# Altium schematic sheet [3]-LEDBoard.SchDoc
size B; SheetNumber: 1; SheetTotal: 2
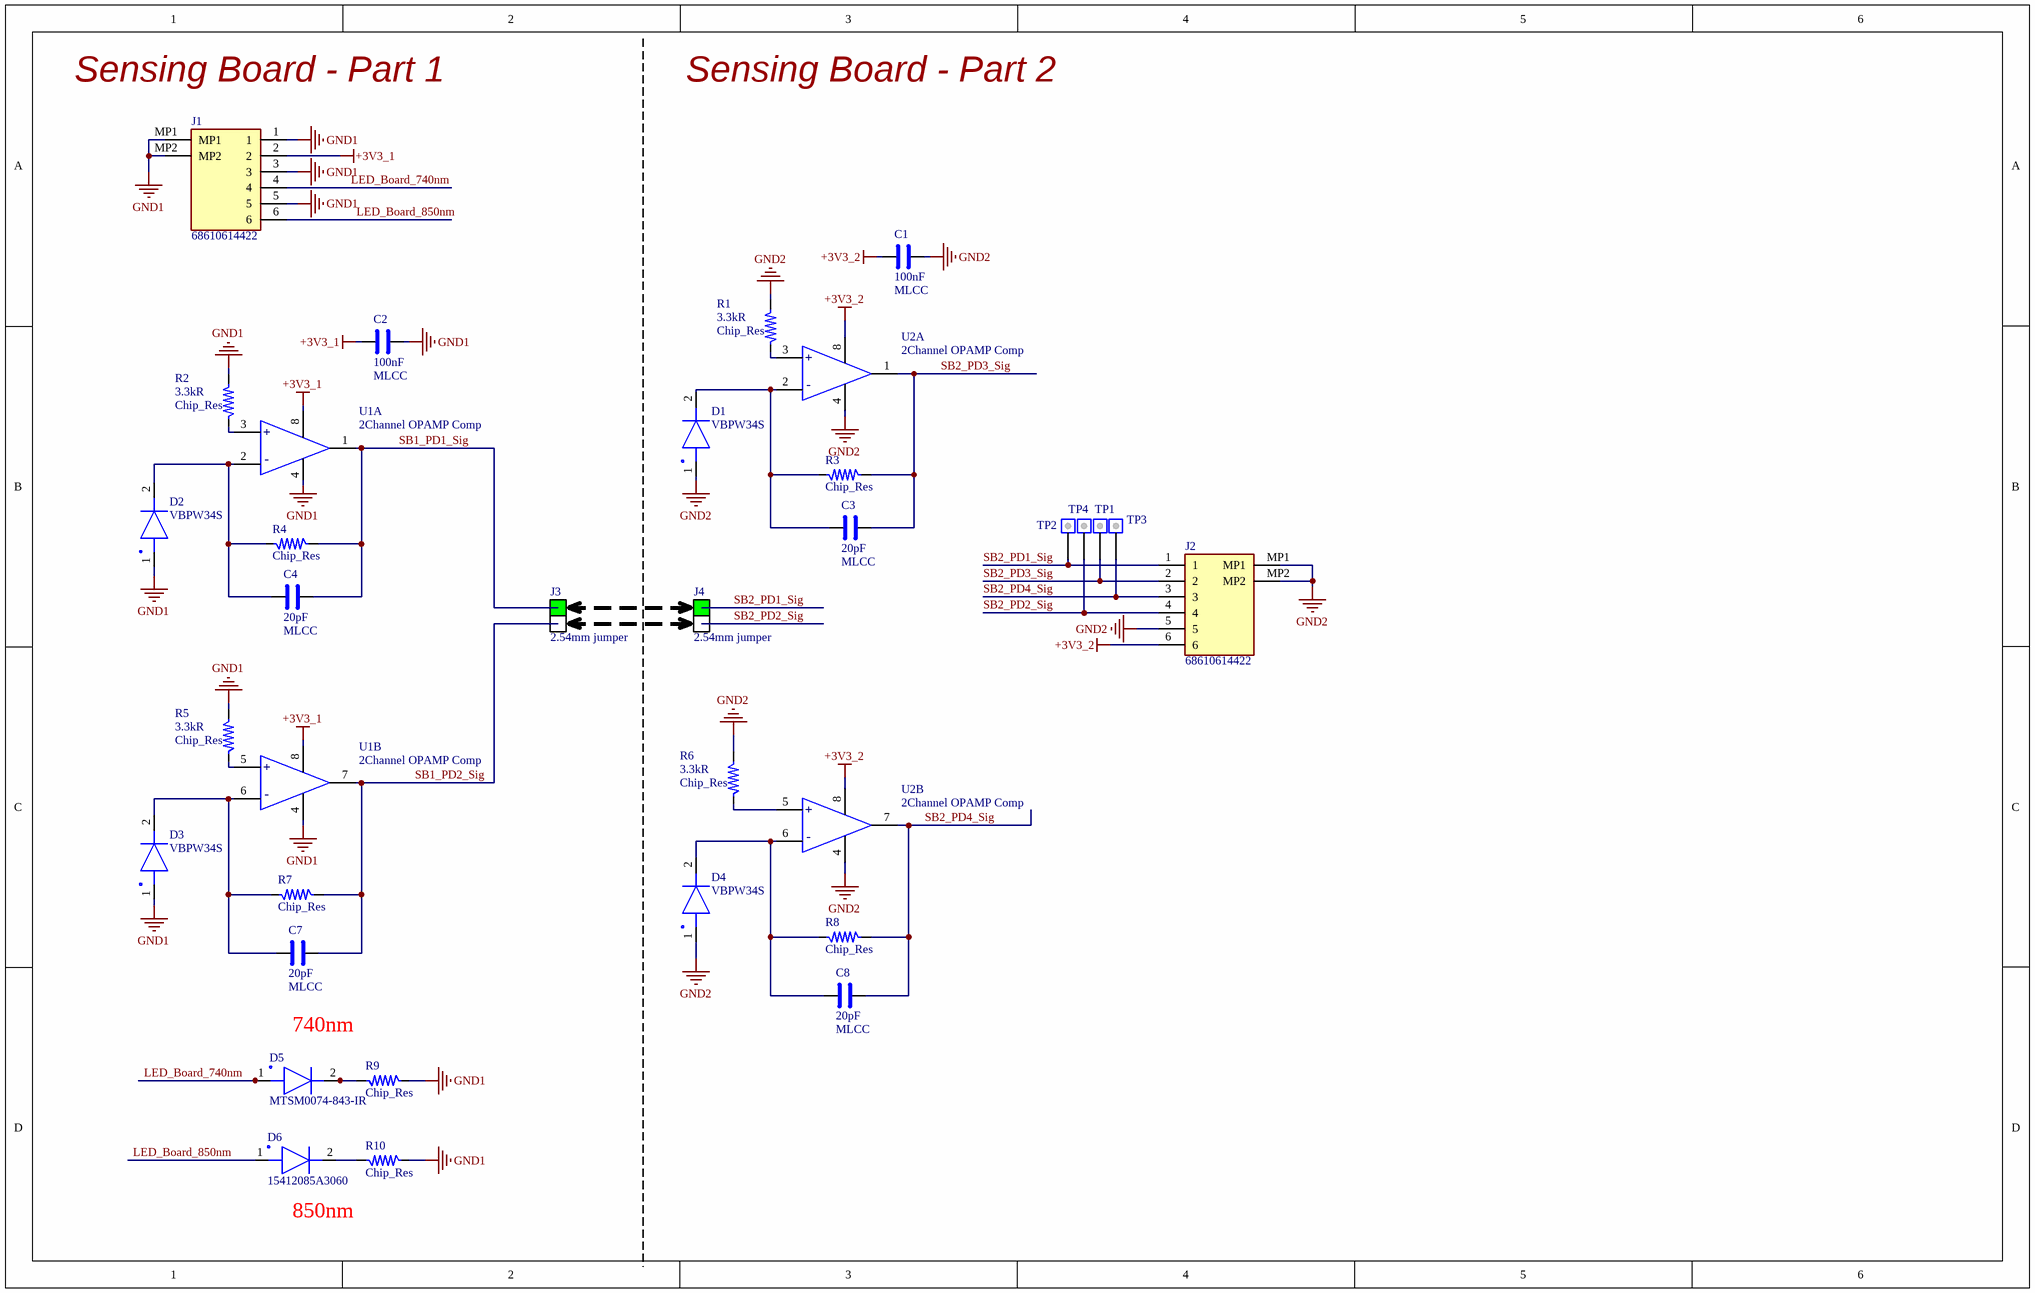
[diagram p0: [3]-LEDBoard.SchDoc]

## Parts
C1  MLCC  value 100nF  [CAPC1005X06L]
C2  MLCC  value 100nF  [CAPC1005X06L]
C3  MLCC  value 20pF  [CAPC1608X09M]
C4  MLCC  value 20pF  [CAPC1608X09M]
C7  MLCC  value 20pF  [CAPC1608X09M]
C8  MLCC  value 20pF  [CAPC1608X09M]
D1  VBPW34S  [VBPW34S]
D2  VBPW34S  [VBPW34S]
D3  VBPW34S  [VBPW34S]
D4  VBPW34S  [VBPW34S]
D5  MTSM0074-843-IR  [MTSM0074-843-IR]
D6  15412085A3060  [15412085A3060]
J1  68610614422  [68610614422]
J2  68610614422  [68610614422]
J3  2.54mm jumper  [FP_Jumper_2x2_54mm]
J4  2.54mm jumper  [FP_Jumper_2x2_54mm]
R1  Chip_Res  value 3.3kR  [RESC1005X04M]
R2  Chip_Res  value 3.3kR  [RESC1005X04M]
R3  Chip_Res  [RESC1608X06M]
R4  Chip_Res  [RESC1608X06M]
R5  Chip_Res  value 3.3kR  [RESC1005X04M]
R6  Chip_Res  value 3.3kR  [RESC1005X04M]
R7  Chip_Res  [RESC1608X06M]
R8  Chip_Res  [RESC1608X06M]
R9  Chip_Res  [RESC1608X06M]
R10  Chip_Res  [RESC1608X06M]
TP1  TP  [FP-TP_SMD_Narrow]  (value not drawn)
TP2  TP  [FP-TP_SMD_Narrow]  (value not drawn)
TP3  TP  [FP-TP_SMD_Narrow]  (value not drawn)
TP4  TP  [FP-TP_SMD_Narrow]  (value not drawn)
U1  2Channel OPAMP Comp  [TSOP65P490X110-8L]  (parts A,B of 2)
U2  2Channel OPAMP Comp  [TSOP65P490X110-8L]  (parts A,B of 2)

## Nets
+3V3_1: C2.1 J1.2 U1.8(VCC)
+3V3_2: C1.1 J2.6 U2.8(VCC)
GND1: C2.2 D2.1(Anode) D3.1(Anode) J1.1 J1.3 J1.5 J1.MP1 J1.MP2 R2.1 R5.1 R9.2 R10.2 U1.4(GND)
GND2: C1.2 D1.1(Anode) D4.1(Anode) J2.5 J2.MP1 J2.MP2 R1.1 R6.1 U2.4(GND)
LED_Board_740nm: D5.1(Anode) J1.4
LED_Board_850nm: D6.1(Anode) J1.6
SB1_PD1_Sig: C4.2 J3.1 R4.1 U1.1(1OUT)
SB1_PD2_Sig: C7.2 J3.2 R7.1 U1.7(2OUT)
SB2_PD1_Sig: J2.1 J4.1 TP2.NODE
SB2_PD2_Sig: J2.4 J4.2 TP4.NODE
SB2_PD3_Sig: C3.2 J2.2 R3.1 TP1.NODE U2.1(1OUT)
SB2_PD4_Sig: C8.2 J2.3 R8.1 TP3.NODE U2.7(2OUT)
NetC3_1: C3.1 D1.2(Cathode) R3.2 U2.2(1IN-)
NetC4_1: C4.1 D2.2(Cathode) R4.2 U1.2(1IN-)
NetC7_1: C7.1 D3.2(Cathode) R7.2 U1.6(2IN-)
NetC8_1: C8.1 D4.2(Cathode) R8.2 U2.6(2IN-)
NetD5_2: D5.2(Cathode) R9.1
NetD6_2: D6.2(Cathode) R10.1
NetR1_2: R1.2 U2.3(1IN+)
NetR2_2: R2.2 U1.3(1IN+)
NetR5_2: R5.2 U1.5(2IN+)
NetR6_2: R6.2 U2.5(2IN+)

## Notes on the sheet
- (near J1) Sensing Board - Part 1
- Sensing Board - Part 2
- 740nm
- 850nm
- (in symbol OPA2380AIDGKR, part A) +
- (in symbol OPA2380AIDGKR, part B) +

## Library data of the parts
C1 C2 = CC0402KRX7R8BB104: Multilayer Ceramic Capacitor, 0.1 uF, 25 V, ± 10%, X7R, 0402 [1005 Metric]; Manufacturer: Yageo; ID: 1; Voltage Rating: 25V; Part Number: CC0402KRX7R8BB104; Table: MLCC 0402; Supplier: Digikey; Supplier Part Number: 311-2077-6-ND; Manufacturer Part Number: CC0402KRX7R8BB104; Tolerance: 10%; Dielectric: X7R; Category: Ceramic Capacitors; Case/Package: 0402; Case Code (Metric): 1005; Case Code (Imperial): 0402; Series: CC
C3 C4 C7 C8 = CC0603JRNPO9BN200: Multilayer Ceramic Capacitor, 20 pF, 50 V, ± 5%, C0G (NP0), 0603 [1608 Metric]; Manufacturer: Yageo; ID: 17; Voltage Rating: 50V; Dielectric: C0G, NP0; Part Number: CC0603JRNPO9BN200; Table: MLCC 0603; Supplier: Digikey; Supplier Part Number: 311-1424-6-ND; Manufacturer Part Number: CC0603JRNPO9BN200; Tolerance: 5%; Category: Ceramic Capacitors; Case/Package: 0603; Case Code (Metric): 1608; Case Code (Imperial): 0603; Series: CC
D1-D4 = VBPW34S: Photodiode 940nm 100ns 130° 2-SMD, Gull Wing; Manufacturer: Vishay; ID: 1; Table: Light Pipe; Part Number: VBPW34S; Manufacturer Part Number: VBPW34S; Supplier Part Number: 751-1500-2-ND; Supplier: Digikey; Category: Photodiodes; RoHS: Yes
D5 = MTSM0074-843-IR: Infrared (IR) Emitter 740nm 1.7V 30mA 3.2mW/sr @ 30mA 1206 (3216 Metric); Manufacturer: Marktech Optoelectronics; ID: 0; Table: LED Inferared; Part Number: MTSM0074-843-IR; Manufacturer Part Number: MTSM0074-843-IR; Supplier Part Number: 1125-MTSM0074-843-IRTR-ND; Supplier: Digikey; Category: LED Emitters - Infrared, UV, Visible; RoHS: Yes
D6 = 15412085A3060: Infrared (IR) Emitter 850nm 1.4V 15mW/sr @ 20mA 30° 1206 (3216 Metric); Manufacturer: Wurth Elektronik; ID: 1; Table: LED Inferared; Part Number: 15412085A3060; Manufacturer Part Number: 15412085A3060; Supplier Part Number: 732-12009-2-ND; Supplier: Digikey; Category: LED Emitters - Infrared, UV, Visible; RoHS: Yes
J1 J2 = 68610614422: 6 Position FPC Connector Contacts, Bottom 0.039" (1.00mm) Surface Mount, Right Angle; Manufacturer: Würth Elektronik; ID: 1; Table: FCC/FPC; Pitch: 1mm; Part Number: 68610614422; Manufacturer Part Number: 68610614422; Supplier Part Number: 732-1994-2-ND; Supplier: Digikey; RoHS: Yes; Category: FFC, FPC (Flat Flexible) Connector Assemblies; Pins: 6; Contact Material: Phosphor Bronze; Contact Plating: Tin; Orientation: Right Angle
J3 J4 = Header2x1: 2x2.54mm conventional header as jumper; ID: 19; Table: Header Connector; Header Orientation: Straight; Pitch: 0.100" (2.54mm); Number of Positions: 2; Number of Levels: 1; Part Number: Header2x1; Connector Type: Header; Category: Connectors; Positions Per Level: 2; Number of Rows: 2
R1 R2 R5 R6 = RC0402JR-073K3L: SMD Chip Resistor, 3.3 kOhm, ± 5%, 63 mW, 0402 [1005 Metric], Thick Film, General Purpose; Manufacturer: Yageo; ID: 20; Power Rating: 62.5mW; Temperature Coefficient: 100ppm/°C; Part Number: RC0402JR-073K3L; Table: Resistor 0402; Manufacturer Part Number: RC0402JR-073K3L; Supplier Part Number: 311-3.3KJRDKR-ND; Supplier: Digikey; Termination: SMD/SMT; Tolerance: 5%; Resistor Type: Thick Film; Series: RC; Features: Moisture Resistant; Category: Chip SMD Resistors; Min Operating Temperature: -55°C; Max Operating Temperature: 155°C; RoHS: Yes; Case/Package: 0402; Case Code (Imperial): 0402; Case Code (Metric): 1005
R3 R4 R7 R8 = RC0603FR-07887RL: Res Thick Film 0603 887 Ohm 1% 1/10W ±100ppm/°C Molded SMD SMD Paper T/R; Manufacturer: Yageo; ID: 3; Value: 887R; Power Rating: 100mW; Part Number: RC0603FR-07887RL; Table: Resistor 0603; Manufacturer Part Number: RC0603FR-07887RL; Supplier Part Number: 311-887HRDKR-ND; Supplier: Digikey; Tolerance: 1%; Resistor Type: Thick Film; Features: Moisture Resistant; Series: RC_L; Temperature Coefficient: 100ppm/°C; RoHS: Yes; Category: Chip SMD Resistors; Case/Package: 0603; Case Code (Imperial): 0603; Case Code (Metric): 1608
R9 R10 = AC0603FR-1333KL: SMD Chip Resistor, 33 kOhm, ± 1%, 100 mW, 0603 [1608 Metric], Thick Film, General Purpose; Manufacturer: Yageo; ID: 9; Value: 33kR; Power Rating: 100mW; Temperature Coefficient: 100ppm/°C; Part Number: AC0603FR-1333KL; Table: Resistor 0603; Manufacturer Part Number: AC0603FR-1333KL; Supplier Part Number: 603-AC0603FR-1333KL; Supplier: Mouser; Tolerance: 1%; Resistor Type: Thick Film; Series: AC; RoHS: Yes; Category: Chip SMD Resistors; Case/Package: 0603; Case Code (Imperial): 0603; Case Code (Metric): 1608
TP1-TP4 = Test Point: A simple test point; ID: 3; Table: Misc; Part Number: Test Point
U1 U2 = OPA2380AIDGKR: Manufacturer: Texas Instruments; ID: 0; Table: IC OP-AMP; Slew Rate: 80 V/us; Gain Bandwidth Product: 90MHz; Part Number: OPA2380AIDGKR; Manufacturer Part Number: OPA2380AIDGKR; Supplier Part Number: 296-48627-2-ND; Supplier: Digikey; Category: Instrumentation, Op Amps, Buffer Amps; RoHS: Yes; Series: -; Case/Package: VSSOP; Mounting Technology: SMD/SMT; Min Operating Temperature: - 40 C; Max Operating Temperature: 125°C